# EasyEDA schematic Analog PI Controller v7.json
TITLE: Analog PI DC Motor Controller; REV: 7.0; Date: 2025-11-15; Sheet: 1/1; Drawn By: Derek Stoddard; Company: Derek Stoddard, Swaroop Handral
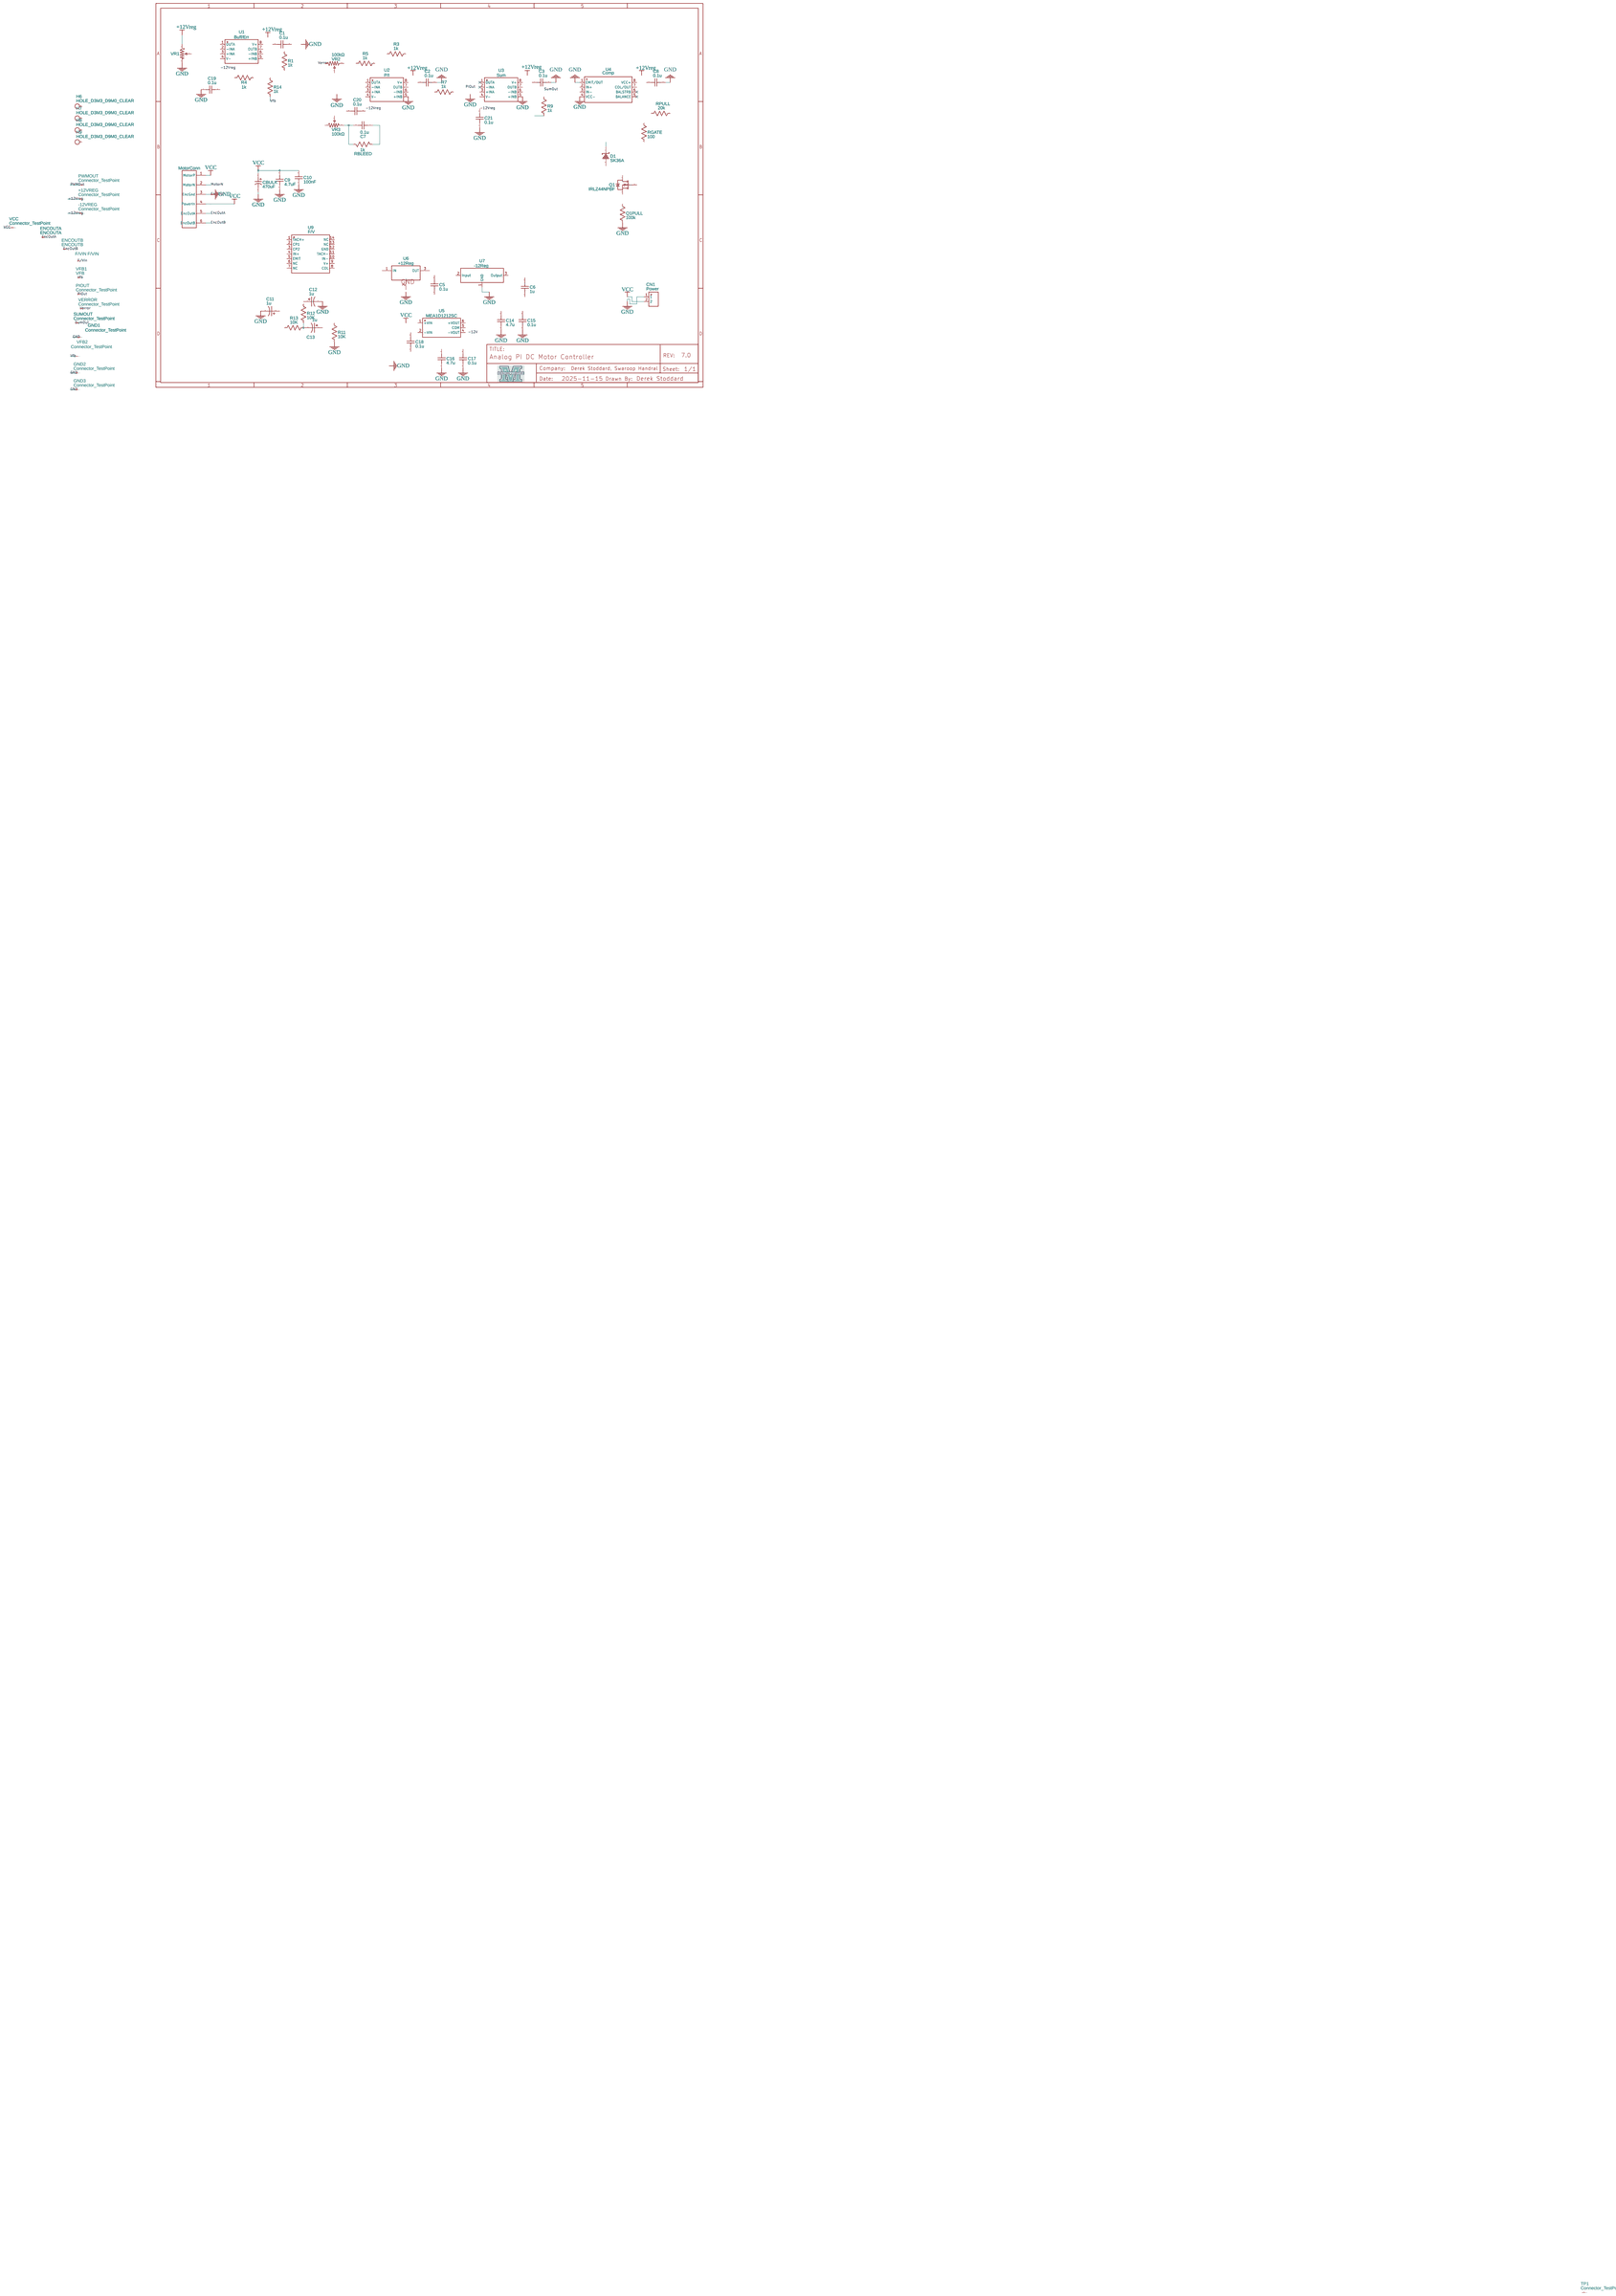
[diagram p0: schematic sheet]

## Parts
+12VREG  Connector_TestPoint  [TESTPOINT:TESTPOINT_PAD_D1.5MM]
-12VREG  Connector_TestPoint  [TESTPOINT:TESTPOINT_PAD_D1.5MM]
C1  0.1u  [C0603]
C2  0.1u  [C0603]
C3  0.1u  [C0603]
C5  0.1u  [C0603]
C6  1u  [C0603]
C7  0.1u  [C0603]
C8  0.1u  [C0603]
C9  4.7uF  [C0603]
C10  100nF  [C0603]
C11  1u  [CASE-A_3216]
C12  1u  [CASE-A_3216]
C13  1u  [CASE-A_3216]
C14  4.7u  [C0603]
C15  0.1u  [C0603]
C16  4.7u  [C0603]
C17  0.1u  [C0603]
C18  0.1u  [C0603]
C19  0.1u  [C0603]
C20  0.1u  [C0603]
C21  0.1u  [C0603]
CBULK  470uF  [CAP-SMD_BD10.0-L10.3-W10.3-FD]
CN1  Power  [CONN-TH_2P-P5.00_691137710002]
D1  SK36A  [SMA_L4.3-W2.6-LS5.2-RD]
ENCOUTA  ENCOUTA  [TESTPOINT:TESTPOINT_PAD_D1.5MM]
ENCOUTB  ENCOUTB  [TESTPOINT:TESTPOINT_PAD_D1.5MM]
F/VIN  F/VIN  [TESTPOINT:TESTPOINT_PAD_D1.5MM]
GND1  Connector_TestPoint  [TESTPOINT:TESTPOINT_PAD_D1.5MM]
GND2  Connector_TestPoint  [TESTPOINT:TESTPOINT_PAD_D1.5MM]
GND3  Connector_TestPoint  [TESTPOINT:TESTPOINT_PAD_D1.5MM]
H6  HOLE_D3M3_D9M0_CLEAR  [HOLE_D3M3_D7M0_PAD]
H7  HOLE_D3M3_D9M0_CLEAR  [HOLE_D3M3_D7M0_PAD]
H8  HOLE_D3M3_D9M0_CLEAR  [HOLE_D3M3_D7M0_PAD]
H9  HOLE_D3M3_D9M0_CLEAR  [HOLE_D3M3_D7M0_PAD]
MIN  MotorConn  [CONN-SMD_6P-P2.54_14110613002000]
PIOUT  Connector_TestPoint  [TESTPOINT:TESTPOINT_PAD_D1.5MM]
PWMOUT  Connector_TestPoint  [TESTPOINT:TESTPOINT_PAD_D1.5MM]
Q1  IRLZ44NPBF  [TO-220-3_L10.0-W4.5-P2.54-T]
Q1PULL  100k  [R0603]
R1  1k  [R0603]
R3  1k  [R0603]
R4  1k  [R0603]
R5  1k  [R0603]
R7  1k  [R0603]
R9  1k  [R0603]
R11  10K  [R0603]
R12  10K  [R0603]
R13  10K  [R0603]
R14  1k  [R0603]
RBLEED  1k  [R0603]
RGATE  100  [R0603]
RPULL  20k  [R0603]
SUMOUT  Connector_TestPoint  [TESTPOINT:TESTPOINT_PAD_D1.5MM]
TP1  Connector_TestPoint  [TESTPOINT:TESTPOINT_PAD_D1.5MM]
U1  Buff/Err  [SOIC-8_L4.9-W3.9-P1.27-LS6.0-BL]
U2  P/I  [SOIC-8_L4.9-W3.9-P1.27-LS6.0-BL]
U3  Sum  [SOIC-8_L4.9-W3.9-P1.27-LS6.0-BL]
U4  Comp  [SOIC-8_L5.0-W4.0-P1.27-LS6.0-BL]
U5  MEA1D1212SC  [PWRM-TH_MEA1DXXXXSC]
U6  +12Reg  [TO-220-3_L10.2-W4.6-P2.54-L]
U7  -12Reg  [TO-220-3_L10.2-W4.6-P2.54-L]
U9  F/V  [SOIC-14_L8.7-W3.9-P1.27-LS6.0-BL]
VCC  Connector_TestPoint  [TESTPOINT:TESTPOINT_PAD_D1.5MM]
VERROR  Connector_TestPoint  [TESTPOINT:TESTPOINT_PAD_D1.5MM]
VFB1  VFB  [TESTPOINT:TESTPOINT_PAD_D1.5MM]
VFB2  Connector_TestPoint  [TESTPOINT:TESTPOINT_PAD_D1.5MM]
VR1  PTV09A-4020U-B104  [PTV09A4020FB103]
VR2  100kΩ  [RES-ADJ-SMD_L4.8-W3.5-P2.50-BL-1]
VR3  100kΩ  [RES-ADJ-SMD_L4.8-W3.5-P2.50-BL-1]

## Library data of the parts
+12VREG -12VREG ENCOUTA ENCOUTB F/VIN GND1-GND3 PIOUT PWMOUT SUMOUT TP1 VCC VERROR VFB1 VFB2 = Connector_TestPoint: Add into BOM: yes; Convert to PCB: yes; Origin Footprint: TestPoint:TestPoint_Pad_D1.5mm; Contributor: lolologe
C1-C3 C5-C8 C14-C21 = C_0603_US: Contributor: LCEDA_Lib
C9 = GRM188R61E475KE11D: Contributor: LCSC; Supplier: LCSC; Supplier Part: C90057; Manufacturer: muRata(村田); JLCPCB Part Class: Extended Part
C10 = GRM033R61E104KE14D: Supplier: LCSC; Manufacturer: muRata(村田); Supplier Part: C76939; JLCPCB Part Class: Extended Part
C11-C13 = C_Tan_SMD_A_US: Contributor: LCEDA_Lib
CBULK = EEEFN1V471UP: Supplier: LCSC; Supplier Part: C494847; Manufacturer: PANASONIC(松下); JLCPCB Part Class: Extended Part; Contributor: lcsc
CN1 = 691137710002: Supplier: LCSC; Supplier Part: C5332011; Manufacturer: Wurth(伍尔特); JLCPCB Part Class: Extended Part; Contributor: lcsc
D1 = SK36A-LTP: Contributor: magnussorlander; Supplier: LCSC; Supplier Part: C106867; Manufacturer: MCC(美微科); JLCPCB Part Class: Extended Part; link: https://lcsc.com/eda_search?q=C106867&%26type=1&ref=editor
H6-H9 = HOLE_D3M3_D9M0_CLEAR: Contributor: andyfierman; sourceId: zBJD82WQ8
MIN = Harting 6P vertical: Manufacturer: Harting; Manufacturer Part: 14110613002000; Supplier: Mouser; Supplier Part: 617-14110613002000; link: https://eu.mouser.com/ProductDetail/HARTING/14110613002000?qs=9nYkJLYMUzvdKofOFiZ6Iw%3D%3D; Contributor: harryhirsch4
Q1 = IRLZ44NPBF: Supplier: LCSC; Manufacturer: Infineon(英飞凌); Supplier Part: C38774; JLCPCB Part Class: Extended Part
Q1PULL R1 R3-R5 R7 R9 R11-R14 RBLEED RGATE RPULL = R_0603_US: Contributor: LCEDA_Lib
U1 = OPA2197ID: Contributor: LCSC; Supplier: LCSC; Supplier Part: C1347222; Manufacturer: TI(德州仪器); JLCPCB Part Class: Extended Part; Package Display: No
U2 U3 = OPA2197ID: Contributor: LCSC; Supplier: LCSC; Supplier Part: C1347222; Manufacturer: TI(德州仪器); JLCPCB Part Class: Extended Part
U4 = LM311DR: Supplier: LCSC; Manufacturer: TI(德州仪器); Supplier Part: C12597; JLCPCB Part Class: Extended Part
U5 = MEA1D1212SC: Supplier: LCSC; Supplier Part: C5382235; Manufacturer: YLPTEC(易川); Contributor: lcsc
U6 = LM7812CT/NOPB: Supplier: LCSC; Supplier Part: C2872599; Manufacturer: TI(德州仪器); JLCPCB Part Class: Extended Part; Contributor: lcsc
U7 = LM7912CT/NOPB: Supplier: LCSC; Supplier Part: C10116; Manufacturer: TI(德州仪器); JLCPCB Part Class: Extended Part; Contributor: lcsc
U9 = LM2917MX/NOPB: Supplier: LCSC; Supplier Part: C914112; Manufacturer: TI(德州仪器); Contributor: lcsc; JLCPCB Part Class: Extended Part
VR1 = PTV09A-4020U-B104: Manufacturer: Bourns Inc.; Supplier: Digi-Key; Supplier Part: PTV09A-4020U-B104-ND; link: https://www.digikey.ca/fr/products/detail/bourns-inc/PTV09A-4020U-B104/3781131; Contributor: Alexandre De Serres
VR2 VR3 = PVG5A104C03R00: Supplier: LCSC; Supplier Part: C7328709; Manufacturer: BOURNS; JLCPCB Part Class: Extended Part; Contributor: lcsc

## Nets
+12Vreg: +12VREG.1 VR1.1
-12Vreg: -12VREG.1 C21.2
F/VIn: F/VIN.1
VCC: C9.2 C10.2 CBULK.1 CN1.2 MIN.1(MotorP) MIN.4(PowerIn) VCC.1
EncGnd: C2.2 C3.2 C8.2 C9.1 C10.1 C11.2 C12.2 C14.1 C15.1 C16.1 C17.1 C19.1 C21.1 CBULK.2 CN1.1 GND1.1 GND2.1 GND3.1 MIN.3(EncGnd) Q1PULL.2 R11.1 U2.5(+INB) U3.5(+INB) U4.1(EMIT/OUT) U4.4(VCC-) U7.1(GND) VR1.3
EncOutA: ENCOUTA.1 MIN.5(EncOutA)
EncOutB: ENCOUTB.1 MIN.6(EncOutB)
MotorN: MIN.2(MotorN)
PIOut: PIOUT.1
PWMOut: PWMOUT.1
SumOut: SUMOUT.1
Verror: VERROR.1
Vfb: R14.1 VFB1.1 VFB2.1
Net-(C7-1): C7.1 RBLEED.2
Net-(C7-2): C7.2 RBLEED.1 VR3.3
Net-(C13-2): C13.2 R12.1 R13.1

Not connected (* = marked no-connect by the designer): C1 1 2; C2 1; C3 1; C5 1 2; C6 1 2; C8 1; C11 1; C12 1; C13 1; C14 2; C15 2; C16 2; C17 2; C18 1 2; C19 2; C20 1 2; D1 1(K) 2(A); H6 1; H7 1; H8 1; H9 1; Q1 1(G) 2(D) 3(S); Q1PULL 1; R1 1 2; R3 1 2; R4 1 2; R5 1 2; R7 1 2; R9 1 2; R11 2; R12 2; R13 2; R14 2; RGATE 1 2; RPULL 1 2; TP1 1; U1 1(OUTA) 2(-INA) 3(+INA) 4(V-) 5(+INB) 6(-INB) 7(OUTB) 8(V+); U2 1(OUTA) 2(-INA) 3(+INA) 4(V-) 6(-INB) 7(OUTB) 8(V+); U3 1(OUTA)* 2(-INA)* 3(+INA) 4(V-) 6(-INB) 7(OUTB) 8(V+); U4 2(IN+) 3(IN-) 5(BALANCE)* 6(BALSTRB)* 7(COL/OUT) 8(VCC+); U5 1(+VIN) 2(-VIN) 4(-VOUT) 5(COM) 6(+VOUT); U6 1(IN) 2(GND) 3(OUT); U7 2(Input) 3(Output); U9 1(TACH+) 2(CP1) 3(CP2) 4(IN+) 5(EMIT) 6(NC) 7(NC) 8(COL) 9(V+) 10(IN-) 11(TACH-) 12(GND) 13(NC) 14(NC); VR1 2; VR2 1 2 3; VR3 1 2
